# EAGLE design Sentral (EAGLE 7.7.0)

## Sheet 1 of 2
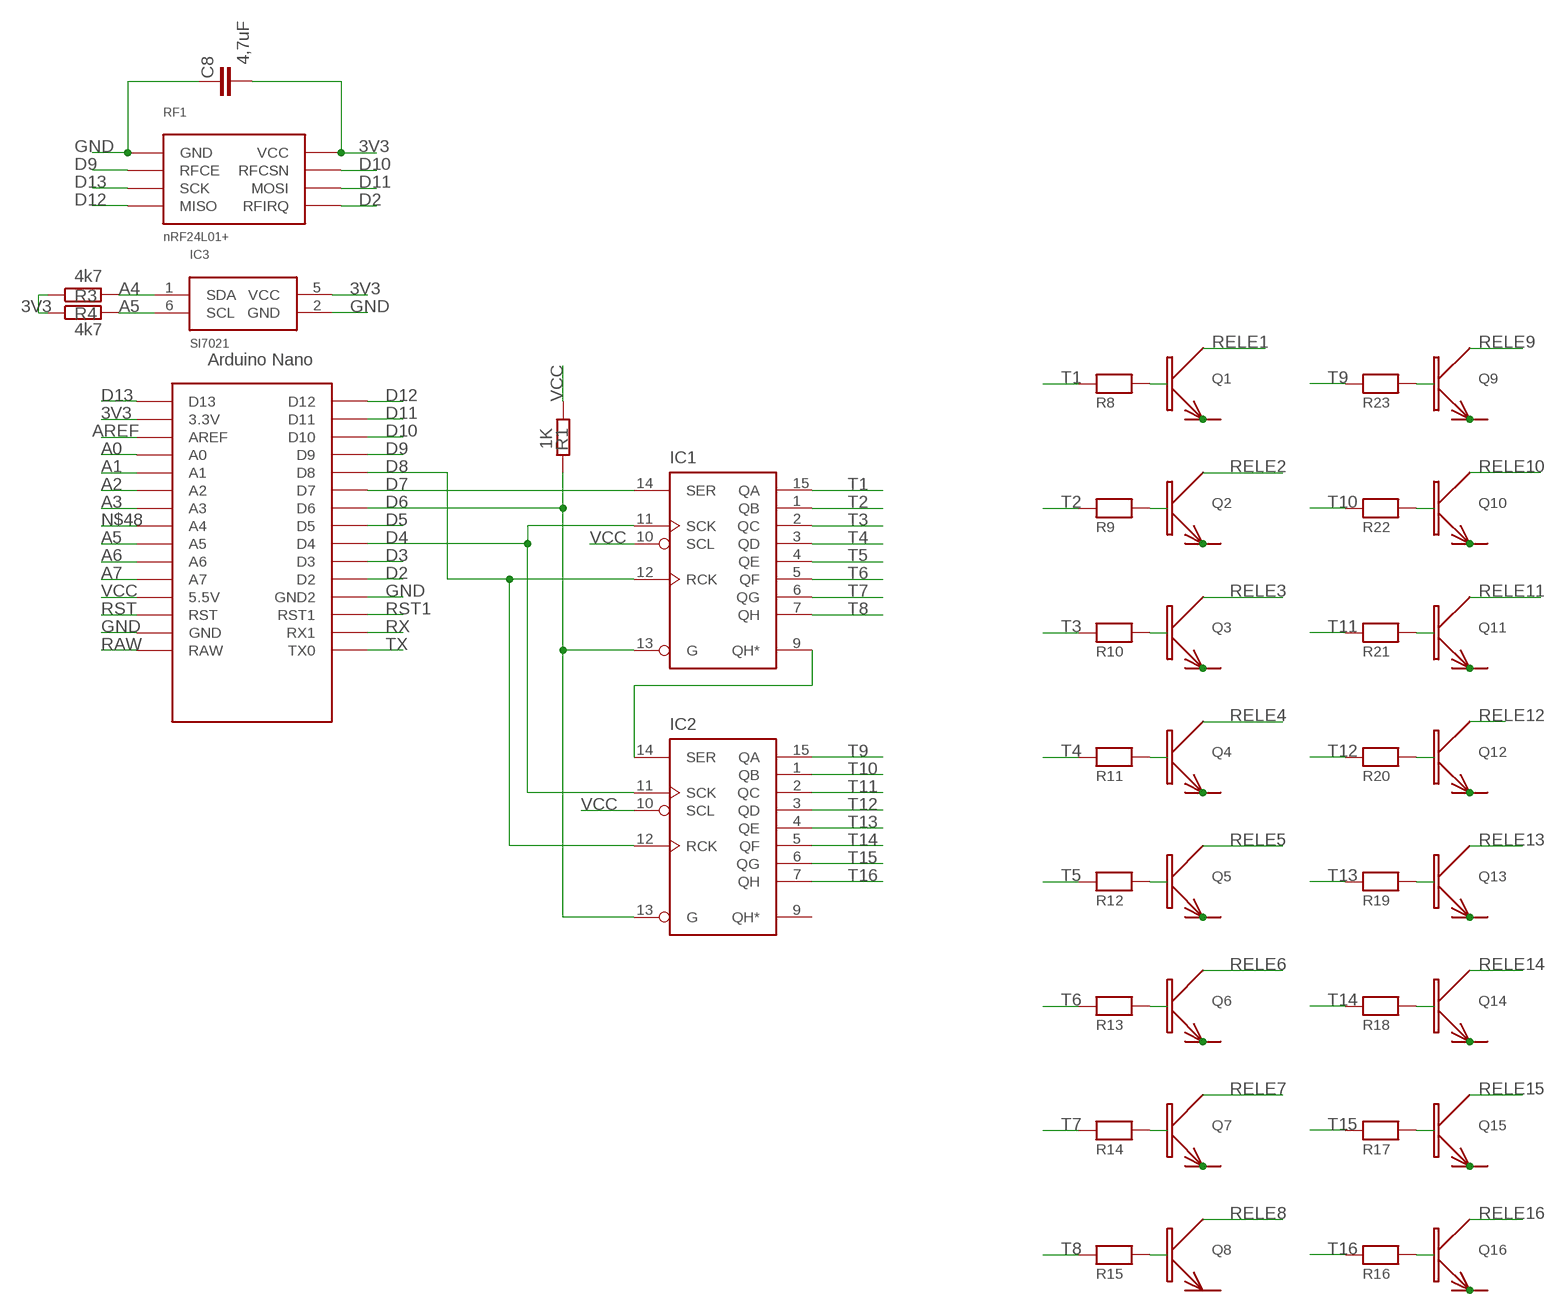
[diagram p0: schematic, sheet 1]

### Parts
C8  4,7uF  C-EUC4532  [C4532]
IC1  74595  [SO-16]
IC2  74595  [SO-16]
IC3  SI7021  [DFN6]
Q1  BC817  [SOT23]
Q2  BC817  [SOT23]
Q3  BC817  [SOT23]
Q4  BC817  [SOT23]
Q5  BC817  [SOT23]
Q6  BC817  [SOT23]
Q7  BC817  [SOT23]
Q8  BC817  [SOT23]
Q9  BC817  [SOT23]
Q10  BC817  [SOT23]
Q11  BC817  [SOT23]
Q12  BC817  [SOT23]
Q13  BC817  [SOT23]
Q14  BC817  [SOT23]
Q15  BC817  [SOT23]
Q16  BC817  [SOT23]
R1  1K  R-EU_R0805  [R0805]
R3  4k7  R-EU_R0805  [R0805]
R4  4k7  R-EU_R0805  [R0805]
R8  RES-A  [A]
R9  RES-A  [A]
R10  RES-A  [A]
R11  RES-A  [A]
R12  RES-A  [A]
R13  RES-A  [A]
R14  RES-A  [A]
R15  RES-A  [A]
R16  RES-A  [A]
R17  RES-A  [A]
R18  RES-A  [A]
R19  RES-A  [A]
R20  RES-A  [A]
R21  RES-A  [A]
R22  RES-A  [A]
R23  RES-A  [A]
RF1  nRF24L01+  NRF24L01  [2X4-2.54MM]
U$1  NANO  [NANO]

### Nets
3V3: C8.1 IC3.5(VCC) R3.1 R4.1 RF1.P$2(VCC) U$1.3.3V ; also sheet 2
A0: U$1.A0
A1: U$1.A1
A2: U$1.A2
A3: U$1.A3
A4: IC3.1(SDA) R3.2
A5: IC3.6(SCL) R4.2 U$1.A5
A6: U$1.A6
A7: U$1.A7
AREF: U$1.AREF
D2: RF1.P$8(RFIRQ) U$1.D2
D3: U$1.D3
D4: IC1.11(SCK) IC2.11(SCK) U$1.D4
D5: U$1.D5
D6: IC1.13(G) IC2.13(G) R1.2 U$1.D6
D7: IC1.14(SER) U$1.D7
D8: IC1.12(RCK) IC2.12(RCK) U$1.D8
D9: RF1.P$3(RFCE) U$1.D9
D10: RF1.P$4(RFCSN) U$1.D10
D11: RF1.P$6(MOSI) U$1.D11
D12: RF1.P$7(MISO) U$1.D12
D13: RF1.P$5(SCK) U$1.D13
GND: C8.2 IC3.2(GND) Q1.1(E) Q2.1(E) Q3.1(E) Q4.1(E) Q5.1(E) Q6.1(E) Q7.1(E) Q8.1(E) Q9.1(E) Q10.1(E) Q11.1(E) Q12.1(E) Q13.1(E) Q14.1(E) Q15.1(E) Q16.1(E) RF1.P$1(GND) U$1.GND U$1.GND1(GND2)
N$6: Q1.2(B) R8.2
N$7: Q2.2(B) R9.2
N$8: Q3.2(B) R10.2
N$9: Q4.2(B) R11.2
N$10: Q5.2(B) R12.2
N$11: Q6.2(B) R13.2
N$12: Q7.2(B) R14.2
N$13: Q8.2(B) R15.2
N$14: IC1.9(QH*) IC2.14(SER)
N$17: Q16.2(B) R16.2
N$18: Q15.2(B) R17.2
N$19: Q14.2(B) R18.2
N$20: Q13.2(B) R19.2
N$27: Q12.2(B) R20.2
N$28: Q11.2(B) R21.2
N$29: Q10.2(B) R22.2
N$36: Q9.2(B) R23.2
N$48: U$1.A4
RAW: U$1.RAW
RELE1: Q1.3(C) ; also sheet 2
RELE2: Q2.3(C) ; also sheet 2
RELE3: Q3.3(C) ; also sheet 2
RELE4: Q4.3(C) ; also sheet 2
RELE5: Q5.3(C) ; also sheet 2
RELE6: Q6.3(C) ; also sheet 2
RELE7: Q7.3(C) ; also sheet 2
RELE8: Q8.3(C) ; also sheet 2
RELE9: Q9.3(C) ; also sheet 2
RELE10: Q10.3(C) ; also sheet 2
RELE11: Q11.3(C) ; also sheet 2
RELE12: Q12.3(C) ; also sheet 2
RELE13: Q13.3(C) ; also sheet 2
RELE14: Q14.3(C) ; also sheet 2
RELE15: Q15.3(C) ; also sheet 2
RELE16: Q16.3(C) ; also sheet 2
RST: U$1.RST
RST1: U$1.RST1
RX: U$1.RX1
T1: IC1.15(QA) R8.1
T2: IC1.1(QB) R9.1
T3: IC1.2(QC) R10.1
T4: IC1.3(QD) R11.1
T5: IC1.4(QE) R12.1
T6: IC1.5(QF) R13.1
T7: IC1.6(QG) R14.1
T8: IC1.7(QH) R15.1
T9: IC2.15(QA) R23.1
T10: IC2.1(QB) R22.1
T11: IC2.2(QC) R21.1
T12: IC2.3(QD) R20.1
T13: IC2.4(QE) R19.1
T14: IC2.5(QF) R18.1
T15: IC2.6(QG) R17.1
T16: IC2.7(QH) R16.1
TX: U$1.TX0
VCC: IC1.10(SCL) IC2.10(SCL) R1.1 U$1.5V(5.5V)
Unconnected: IC2.9(QH*) U$1.ICSP1 U$1.ICSP2 U$1.ICSP3 U$1.ICSP4 U$1.ICSP5 U$1.ICSP6

## Sheet 2 of 2
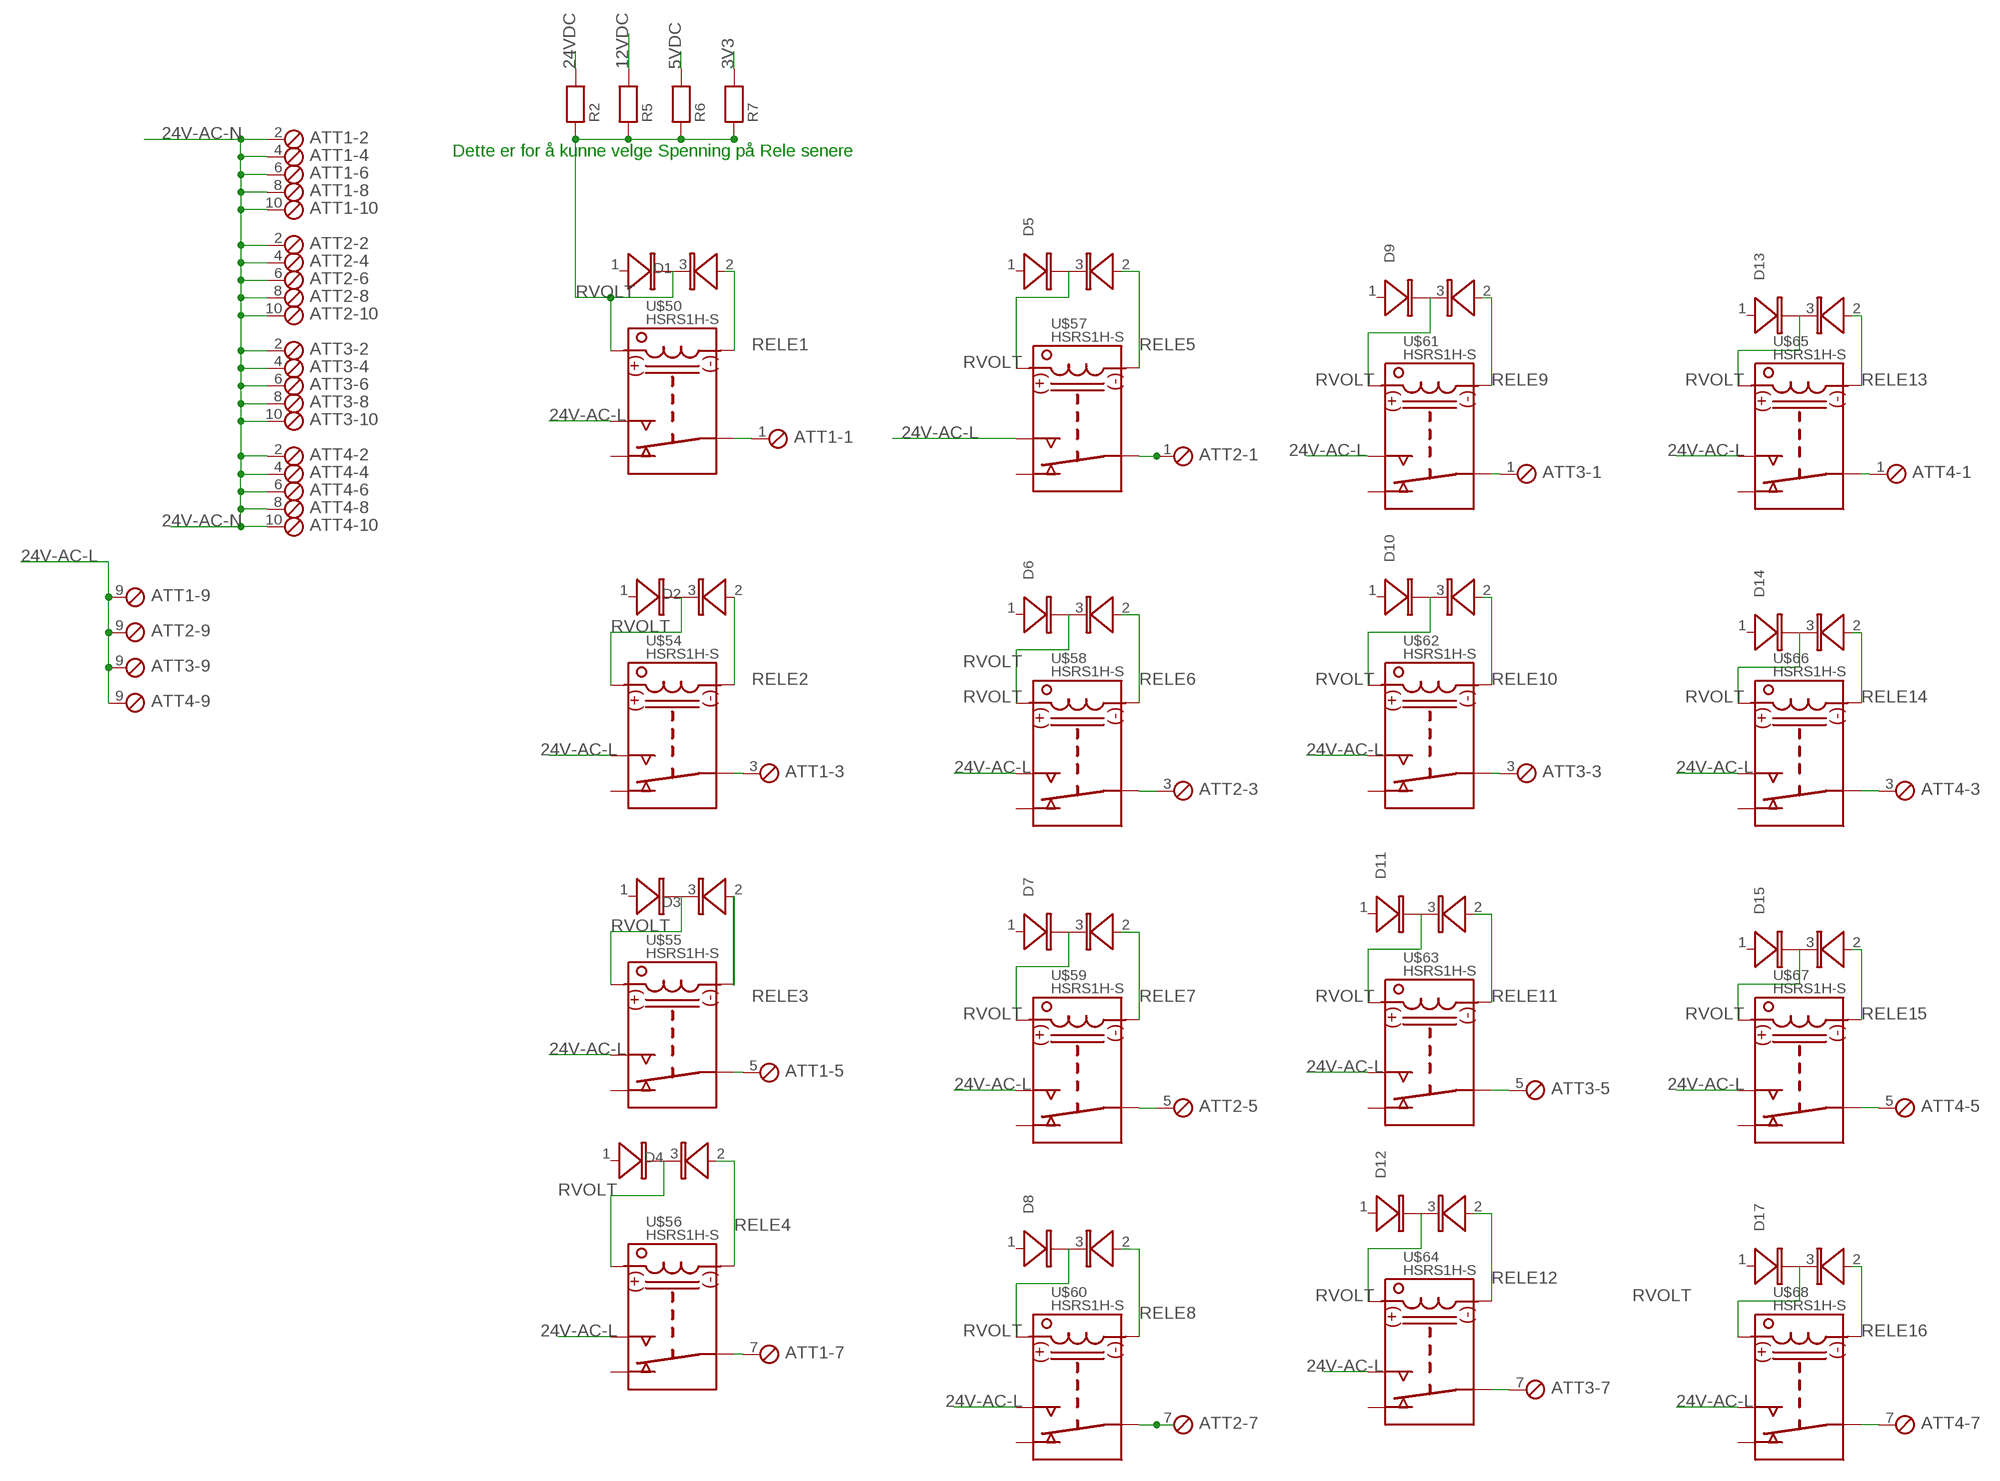
[diagram p1: schematic, sheet 2]

### Parts
ATT1  MPT10  [10POL254]
ATT2  MPT10  [10POL254]
ATT3  MPT10  [10POL254]
ATT4  MPT10  [10POL254]
D1  BAV70  [SOT23]
D2  BAV70  [SOT23]
D3  BAV70  [SOT23]
D4  BAV70  [SOT23]
D5  BAV70  [SOT23]
D6  BAV70  [SOT23]
D7  BAV70  [SOT23]
D8  BAV70  [SOT23]
D9  BAV70  [SOT23]
D10  BAV70  [SOT23]
D11  BAV70  [SOT23]
D12  BAV70  [SOT23]
D13  BAV70  [SOT23]
D14  BAV70  [SOT23]
D15  BAV70  [SOT23]
D17  BAV70  [SOT23]
R2  RES-C  [C]
R5  RES-C  [C]
R6  RES-C  [C]
R7  RES-C  [C]
U$50  HSRS1H-S  [DIL12RLY]
U$54  HSRS1H-S  [DIL12RLY]
U$55  HSRS1H-S  [DIL12RLY]
U$56  HSRS1H-S  [DIL12RLY]
U$57  HSRS1H-S  [DIL12RLY]
U$58  HSRS1H-S  [DIL12RLY]
U$59  HSRS1H-S  [DIL12RLY]
U$60  HSRS1H-S  [DIL12RLY]
U$61  HSRS1H-S  [DIL12RLY]
U$62  HSRS1H-S  [DIL12RLY]
U$63  HSRS1H-S  [DIL12RLY]
U$64  HSRS1H-S  [DIL12RLY]
U$65  HSRS1H-S  [DIL12RLY]
U$66  HSRS1H-S  [DIL12RLY]
U$67  HSRS1H-S  [DIL12RLY]
U$68  HSRS1H-S  [DIL12RLY]

### Nets
3V3: R7.2 ; also sheet 1
5VDC: R6.2
12VDC: R5.2
24V-AC-L: ATT1.9 ATT2.9 ATT3.9 ATT4.9 U$50.1 U$54.1 U$55.1 U$56.1 U$57.1 U$58.1 U$59.1 U$60.1 U$61.1 U$62.1 U$63.1 U$64.1 U$65.1 U$66.1 U$67.1 U$68.1
24V-AC-N: ATT1.2 ATT1.4 ATT1.6 ATT1.8 ATT1.10 ATT2.2 ATT2.4 ATT2.6 ATT2.8 ATT2.10 ATT3.2 ATT3.4 ATT3.6 ATT3.8 ATT3.10 ATT4.2 ATT4.4 ATT4.6 ATT4.8 ATT4.10
24VDC: R2.2
N$1: ATT2.1 U$57.6(6,7) U$57.7(6,7)
N$2: ATT2.3 U$58.6(6,7) U$58.7(6,7)
N$3: ATT2.5 U$59.6(6,7) U$59.7(6,7)
N$4: ATT2.7 U$60.6(6,7) U$60.7(6,7)
N$16: ATT1.1 U$50.6(6,7) U$50.7(6,7)
N$25: ATT1.3 U$54.6(6,7) U$54.7(6,7)
N$34: ATT1.5 U$55.6(6,7) U$55.7(6,7)
N$38: ATT3.7 U$64.6(6,7) U$64.7(6,7)
N$40: ATT4.1 U$65.6(6,7) U$65.7(6,7)
N$41: ATT3.5 U$63.6(6,7) U$63.7(6,7)
N$42: ATT3.3 U$62.6(6,7) U$62.7(6,7)
N$43: ATT3.1 U$61.6(6,7) U$61.7(6,7)
N$44: ATT4.3 U$66.6(6,7) U$66.7(6,7)
N$45: ATT4.5 U$67.6(6,7) U$67.7(6,7)
N$47: ATT4.7 U$68.6(6,7) U$68.7(6,7)
N$64: ATT1.7 U$56.6(6,7) U$56.7(6,7)
RELE1: D1.2(A2) U$50.11 ; also sheet 1
RELE2: D2.2(A2) U$54.11 ; also sheet 1
RELE3: D3.2(A2) U$55.11 ; also sheet 1
RELE4: D4.2(A2) U$56.11 ; also sheet 1
RELE5: D5.2(A2) U$57.11 ; also sheet 1
RELE6: D6.2(A2) U$58.11 ; also sheet 1
RELE7: D7.2(A2) U$59.11 ; also sheet 1
RELE8: D8.2(A2) U$60.11 ; also sheet 1
RELE9: D9.2(A2) U$61.11 ; also sheet 1
RELE10: D10.2(A2) U$62.11 ; also sheet 1
RELE11: D11.2(A2) U$63.11 ; also sheet 1
RELE12: D12.2(A2) U$64.11 ; also sheet 1
RELE13: D13.2(A2) U$65.11 ; also sheet 1
RELE14: D14.2(A2) U$66.11 ; also sheet 1
RELE15: D15.2(A2) U$67.11 ; also sheet 1
RELE16: D17.2(A2) U$68.11 ; also sheet 1
RVOLT: D1.3(K) D2.3(K) D3.3(K) D4.3(K) D5.3(K) D6.3(K) D7.3(K) D8.3(K) D9.3(K) D10.3(K) D11.3(K) D12.3(K) D13.3(K) D14.3(K) D15.3(K) D17.3(K) R2.1 R5.1 R6.1 R7.1 U$50.2 U$54.2 U$55.2 U$56.2 U$57.2 U$58.2 U$59.2 U$60.2 U$61.2 U$62.2 U$63.2 U$64.2 U$65.2 U$66.2 U$67.2 U$68.2
Unconnected: D1.1(A1) D2.1(A1) D3.1(A1) D4.1(A1) D5.1(A1) D6.1(A1) D7.1(A1) D8.1(A1) D9.1(A1) D10.1(A1) D11.1(A1) D12.1(A1) D13.1(A1) D14.1(A1) D15.1(A1) D17.1(A1) U$50.12 U$54.12 U$55.12 U$56.12 U$57.12 U$58.12 U$59.12 U$60.12 U$61.12 U$62.12 U$63.12 U$64.12 U$65.12 U$66.12 U$67.12 U$68.12

### Notes on the sheet
- Dette er for å kunne velge Spenning på Rele senere

## Power pins joined to a net without a drawn wire
GND: IC1.8(GND) IC2.8(GND)
VCC: IC1.16(VCC) IC2.16(VCC)

## Library data of the parts
ATT1-ATT4 = con-phoenix-254:MPT10: PHOENIX CONNECTOR
C8 = rcl:C-EU: CAPACITOR, European symbol
D1-D15 D17 = DISC-SMD:BAV70
IC1 IC2 = 74XXSMD:74595
IC3 = Sensor:SI7021
Q1-Q16 = DISC-SMD:BC817
R1 R3 R4 = rcl:R-EU_: RESISTOR, European symbol
R2 R5-R7 = rlc-smd:RES-C
R8-R23 = rlc-smd:RES-A
RF1 = matrix:NRF24L01
U$1 = AWP-Lib2:NANO: Arduino Nano
U$50 U$54-U$68 = Relay-IKE:HSRS1H-S

## Net classes
0 default: width 0.203 mm

## Board
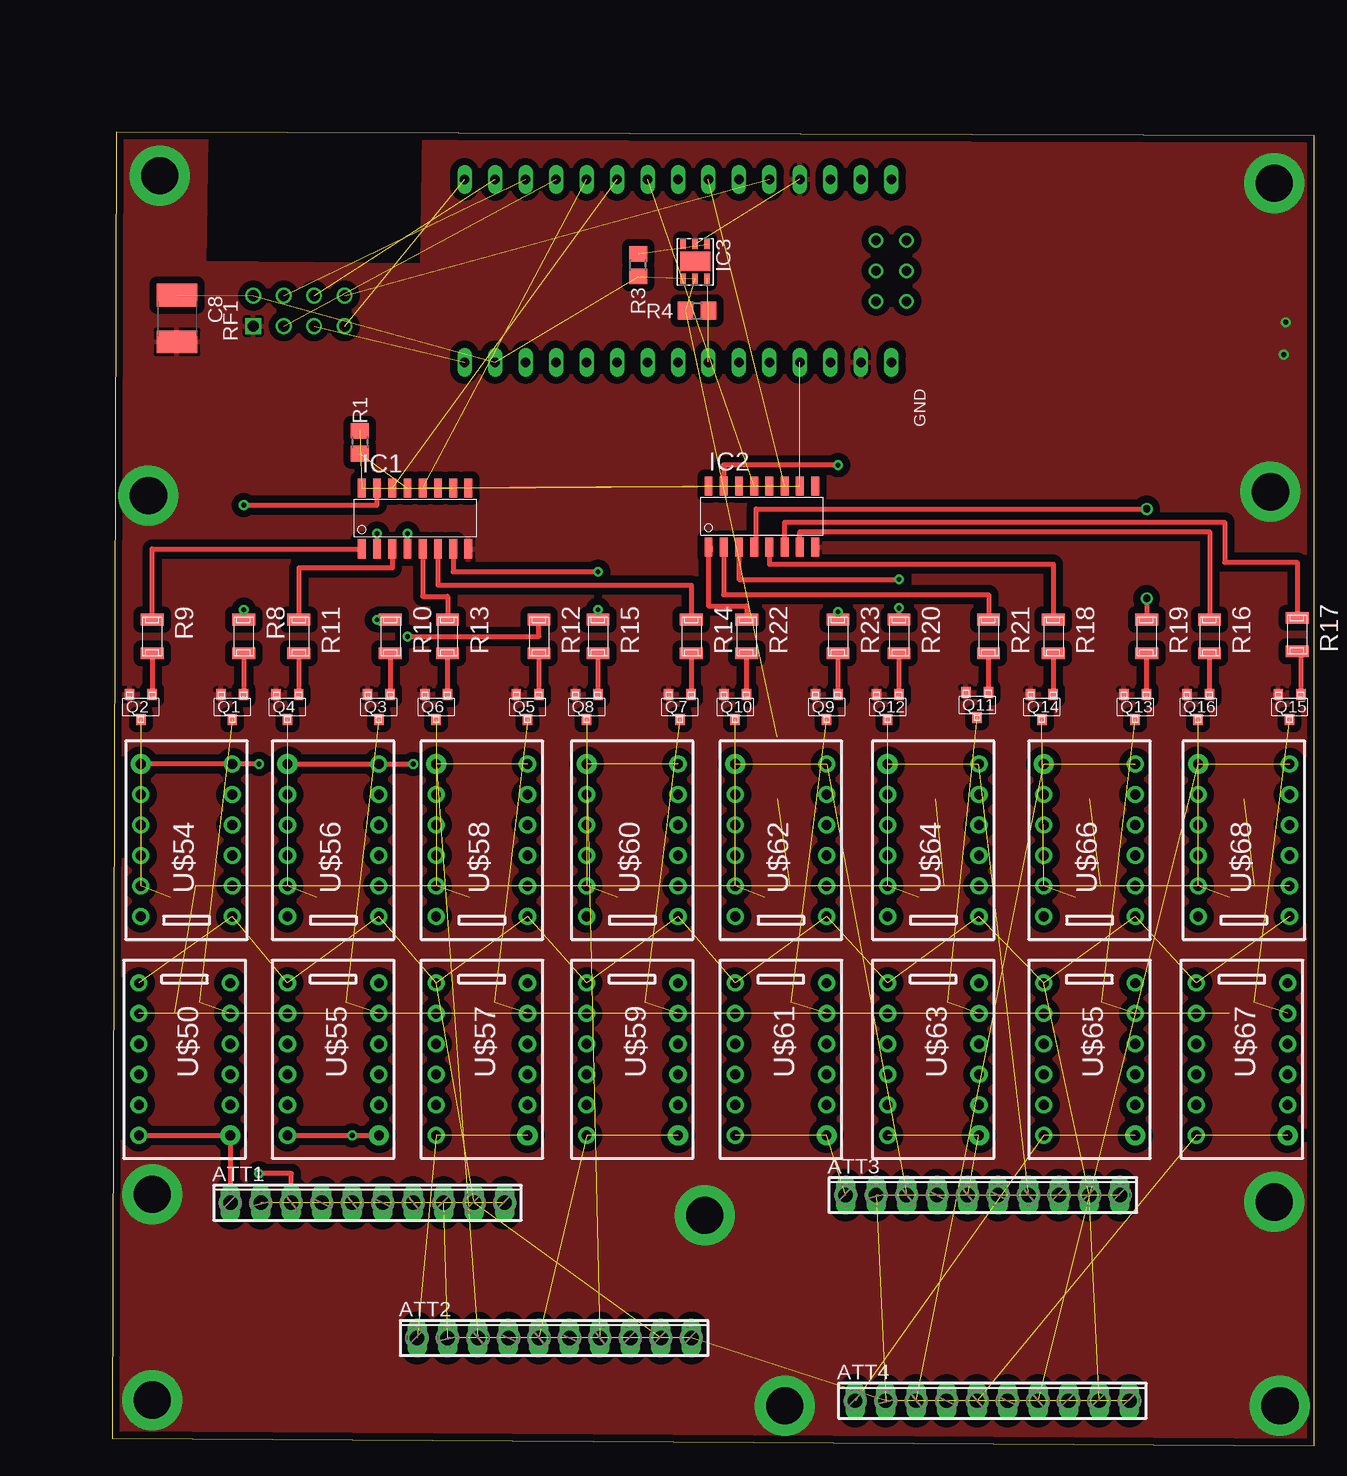
[diagram p2: board, top side]
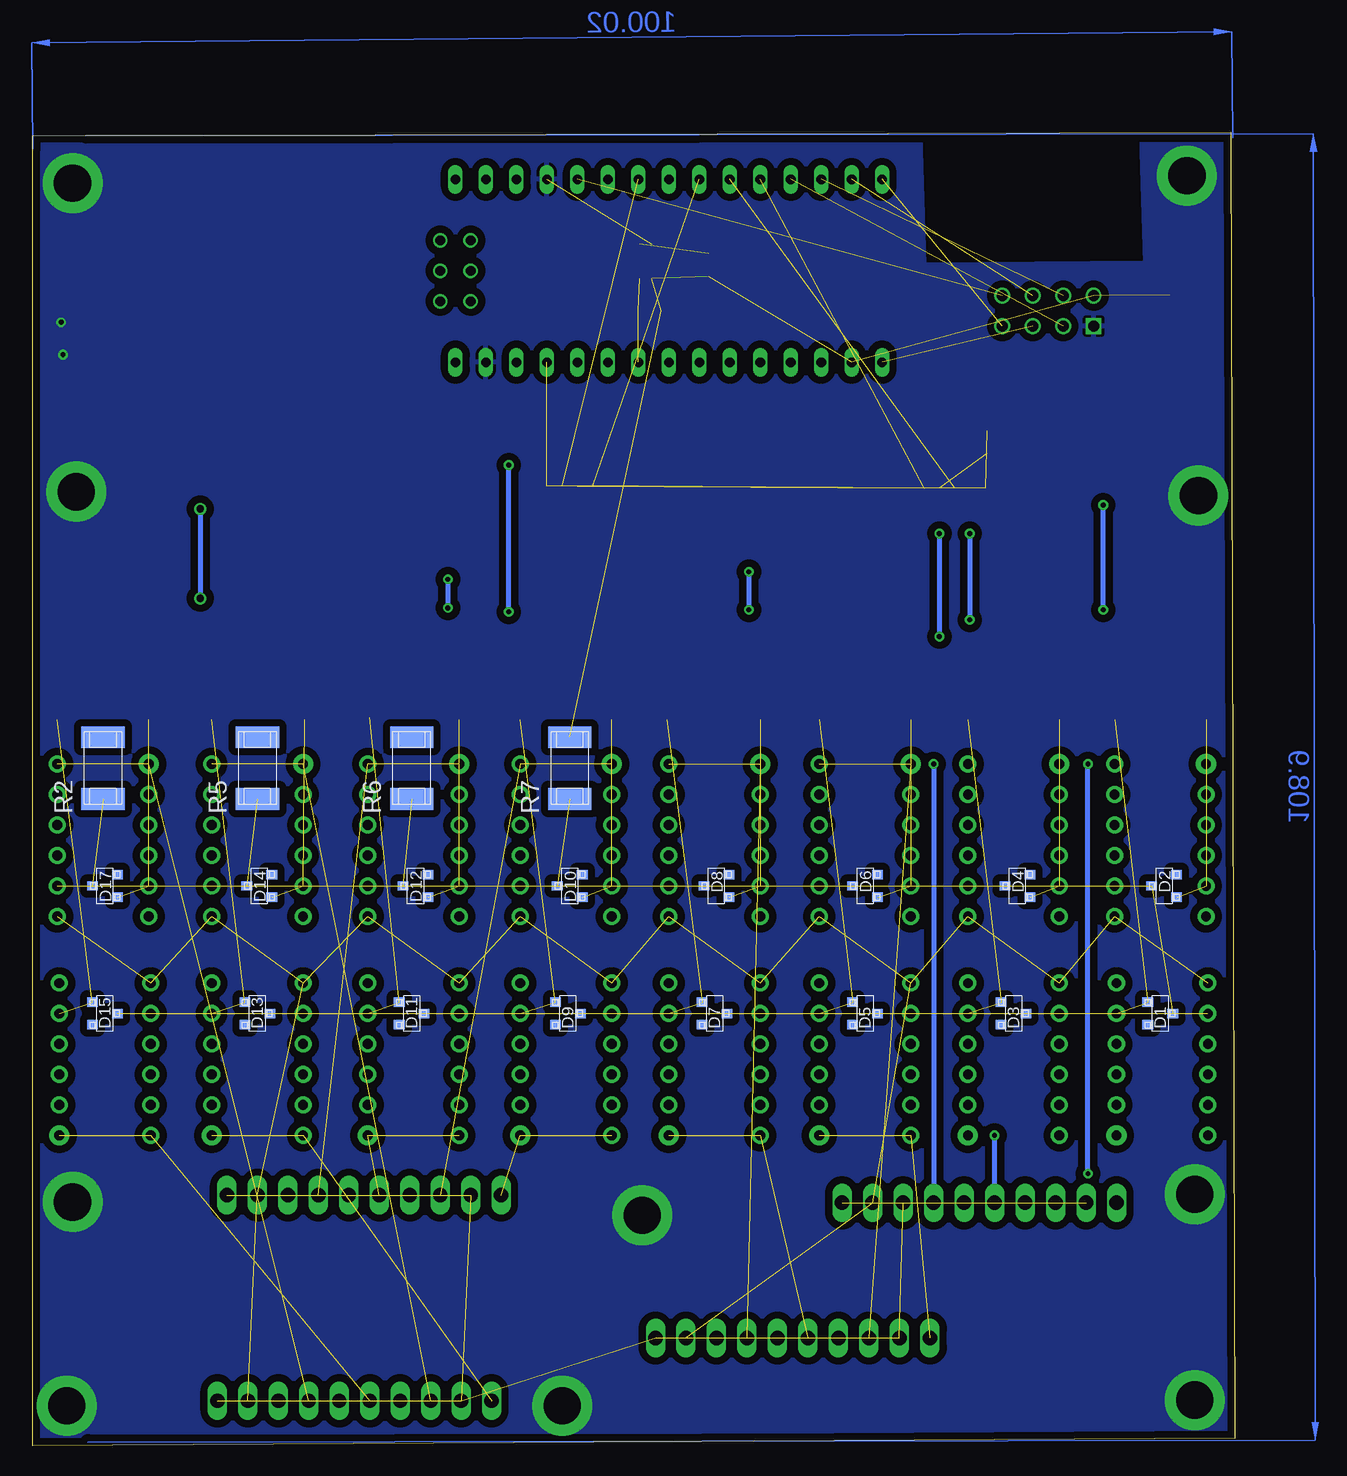
[diagram p3: board, bottom side, seen from below]

Size 100.15 x 109.52 mm. Coordinates in mm from the lower left corner, seen from the top.
Outline: 0,0.64 100.15,0 100.15,109.21 0.32,109.52 0,0.64
Copper layers (1*16): Top 0.035mm / dielectric 1.5mm / Bottom 0.035mm
Design rules "8mil_capinor": minimum track width 4mil, minimum drill 0.2997mm, track to track 8mil, track to pad 8mil, pad to pad 8mil, via to via 8mil, smd to smd 0mil, copper to edge 16mil, drill to drill 16mil, minimum pad ring 8mil, minimum via ring 8mil, stop-mask expansion 0mil, vias tented up to drill 16mil, thermal gap 10mil

### Footprints (pad centres in the part's own frame; a part is rotated, then mirrored left to right if it is on the bottom)
10POL254 = drill 1.2 long: 1 -11.43,0; 2 -8.89,0; 3 -6.35,0; 4 -3.81,0; 5 -1.27,0; 6 1.27,0; 7 3.81,0; 8 6.35,0; 9 8.89,0; 10 11.43,0
C4532 = smd 1.9 x 3.4: 1 -1.95,0; 2 1.95,0
SOT23 = smd 0.889 x 0.787: 1 -1.041,-0.94; 2 -1.041,0.94; 3 1.041,0
SO-16 = smd 0.66 x 1.6: 1 -4.445,-2.54; 2 -3.175,-2.54; 3 -1.905,-2.54; 4 -0.635,-2.54; 5 0.635,-2.54; 6 1.905,-2.54; 7 3.175,-2.54; 8 4.445,-2.54; 9 4.445,2.54; 10 3.175,2.54; 11 1.905,2.54; 12 0.635,2.54; 13 -0.635,2.54; 14 -1.905,2.54; 15 -3.175,2.54; 16 -4.445,2.54
DFN6 = smd 0.85 x 0.45: 1 -1.45,1; 2 -1.45,0; 3 -1.45,-1; 4 1.45,-1; 5 1.45,0; 6 1.45,1 | smd 1.6 x 2.5: P$1 0,0
R0805 = smd 1.3 x 1.5: 1 -0.95,0; 2 0.95,0
C = smd 1.803 x 3.607: 1 -2.591,0; 2 2.565,0
A = smd 0.991 x 1.905: 1 -1.397,0; 2 1.397,0
2X4-2.54MM = drill 0.9 square: P$1 0,0 | drill 0.9: P$2 2.54,0; P$3 0,-2.54; P$4 2.54,-2.54; P$5 0,-5.08; P$6 2.54,-5.08; P$7 0,-7.62; P$8 2.54,-7.62
NANO = drill 0.8 long: 3.3V -10.16,24.13; 5V -10.16,-1.27; A0 -10.16,19.05; A1 -10.16,16.51; A2 -10.16,13.97; A3 -10.16,11.43; A4 -10.16,8.89; A5 -10.16,6.35; A6 -10.16,3.81; A7 -10.16,1.27; AREF -10.16,21.59; D2 5.08,1.27; D3 5.08,3.81; D4 5.08,6.35; D5 5.08,8.89; D6 5.08,11.43; D7 5.08,13.97; D8 5.08,16.51; D9 5.08,19.05; D10 5.08,21.59; D11 5.08,24.13; D12 5.08,26.67; D13 -10.16,26.67; GND -10.16,-6.35; GND1 5.08,-1.27; RAW -10.16,-8.89; RST -10.16,-3.81; RST1 5.08,-3.81; RX1 5.08,-6.35; TX0 5.08,-8.89 | drill 0.8: ICSP1 -5.08,-10.16; ICSP2 -5.08,-7.62; ICSP3 -2.54,-10.16; ICSP4 -2.54,-7.62; ICSP5 0,-10.16; ICSP6 0,-7.62
DIL12RLY = drill 0.813 pad 1.422: 1 -7.62,-2.54; 2 -5.08,-2.54; 3 -2.54,-2.54; 4 0,-2.54; 5 2.54,-2.54; 6 5.08,-2.54; 8 2.54,5.08; 9 0,5.08; 10 -2.54,5.08; 11 -5.08,5.08; 12 -7.62,5.08 | drill 0.813 pad 1.676: 7 5.08,5.08

### Placement (x,y rotation side)
ATT1  21.27,20.26 0 top
ATT2  36.83,8.99 0 top
ATT3  72.55,20.9 0 top
ATT4  73.34,3.75 0 top
C8  5.4,93.98 270 top
D1  6.19,36.04 0 bottom
D2  5.87,46.67 180 bottom
D3  18.41,36.04 0 bottom
D4  18.1,46.67 180 bottom
D5  30.8,36.04 0 bottom
D6  30.8,46.67 180 bottom
D7  43.34,36.04 0 bottom
D8  43.18,46.67 180 bottom
D9  55.56,36.04 0 bottom
D10  55.4,46.67 180 bottom
D11  68.58,36.04 0 bottom
D12  68.26,46.67 180 bottom
D13  81.44,36.04 0 bottom
D14  81.28,46.67 180 bottom
D15  94.14,36.04 0 bottom
D17  94.14,46.67 180 bottom
IC1  25.24,77.31 0 top
IC2  54.13,77.47 0 top
IC3  48.58,98.74 270 top
Q1  10,61.59 270 top
Q2  2.38,61.59 270 top
Q3  22.22,61.59 270 top
Q4  14.6,61.59 270 top
Q5  34.61,61.59 270 top
Q6  26.99,61.59 270 top
Q7  47.31,61.59 270 top
Q8  39.53,61.59 270 top
Q9  59.53,61.59 270 top
Q10  51.91,61.59 270 top
Q11  72.07,61.75 270 top
Q12  64.61,61.59 270 top
Q13  85.25,61.59 270 top
Q14  77.47,61.59 270 top
Q15  98.11,61.59 270 top
Q16  90.49,61.59 270 top
R1  20.64,83.66 270 top
R2  94.3,56.52 90 bottom
R3  43.81,98.42 90 top
R4  48.74,94.61 0 top
R5  81.44,56.52 90 bottom
R6  68.58,56.52 90 bottom
R7  55.4,56.52 90 bottom
R8  10.95,67.47 270 top
R9  3.33,67.47 270 top
R10  23.18,67.47 270 top
R11  15.56,67.47 270 top
R12  35.56,67.47 270 top
R13  27.94,67.47 270 top
R14  48.26,67.47 270 top
R15  40.48,67.47 270 top
R16  91.44,67.47 270 top
R17  98.74,67.63 270 top
R18  78.42,67.47 270 top
R19  86.2,67.47 270 top
R20  65.56,67.47 270 top
R21  73.02,67.47 270 top
R22  52.86,67.47 270 top
R23  60.48,67.47 270 top
RF1  11.75,93.34 90 top
U$1  56.04,100.49 90 top
U$50  4.76,30.96 270 top
U$54  7.46,51.75 90 top
U$55  17.14,30.96 270 top
U$56  19.68,51.75 90 top
U$57  29.53,30.96 270 top
U$58  32.07,51.75 90 top
U$59  42.07,30.96 270 top
U$60  44.61,51.75 90 top
U$61  54.45,30.96 270 top
U$62  56.99,51.75 90 top
U$63  67.15,30.96 270 top
U$64  69.69,51.75 90 top
U$65  80.17,30.96 270 top
U$66  82.71,51.75 90 top
U$67  92.87,30.96 270 top
U$68  95.57,51.75 90 top

### Tracks (layer width: path | path; a pad name or v marks a point on that pad's centre or on a via)
3V3  (6 unrouted)
24V-AC-L  (19 unrouted)
24V-AC-N  (19 unrouted)
A4  (1 unrouted)
A5  (2 unrouted)
D2  (1 unrouted)
D4  (2 unrouted)
D6  (3 unrouted)
D7  (1 unrouted)
D8  (2 unrouted)
D9  (1 unrouted)
D10  (1 unrouted)
D11  (1 unrouted)
D12  (1 unrouted)
D13  (1 unrouted)
GND  (via drill 0.4, 3.1 pad 5)  (1 unrouted)
  Top 0.406: IC2.8 58.59,74.93
  other vias: 3.97,105.89 97.79,93.66 97.63,90.96 3.33,3.81 96.84,105.25 3.02,79.22 97.31,3.33 56.04,3.33 96.52,79.53 96.84,20.32 49.37,19.21 3.33,20.95
  pour Bottom (isolate 0.61): 0.32,109.22 7.78,109.22 7.46,98.58 25.88,98.42 26.19,109.38 100.01,109.06 100.49,87.63 100.49,0 -0.16,0.48
  pour Top (isolate 0.61): 0.32,109.22 7.78,109.22 7.62,98.58 25.88,98.42 26.03,109.38 100.33,108.9 100.65,85.09 100.65,0.16 0.16,0.48
N$1  (2 unrouted)
N$2  (2 unrouted)
N$3  (2 unrouted)
N$4  (2 unrouted)
N$6
  Top 0.406: R8.2 10.94,66.07 Q1.2
N$7
  Top 0.406: R9.2 3.32,66.07 Q2.2
N$8
  Top 0.406: R10.2 23.17,66.07 Q3.2
N$9
  Top 0.406: R11.2 Q4.2
N$10
  Top 0.406: R12.2 Q5.2
N$11
  Top 0.406: R13.2 Q6.2
N$12
  Top 0.406: R14.2 Q7.2
N$13
  Top 0.406: R15.2 40.47,66.07 Q8.2
N$14  (1 unrouted)
N$16
  Top 0.406: U$50.6 U$50.7 ATT1.1
N$17
  Top 0.406: R16.2 Q16.2
N$18
  Top 0.406: R17.2 99.05,66.23 Q15.2
N$19
  Top 0.406: R18.2 78.41,66.07 Q14.2
N$20
  Top 0.406: R19.2 Q13.2
N$25  (via drill 0.4)
  Top 0.406: ATT1.3 14.92,22.7 v12.22,22.7 | v12.22,56.83 U$54.6 U$54.7
  Bottom 0.406: v12.22,22.7 v12.22,56.83
N$27
  Top 0.406: R20.2 65.55,66.07 Q12.2
N$28
  Top 0.406: R21.2 73.01,66.07 Q11.2
N$29
  Top 0.406: R22.2 52.85,66.07 Q10.2
N$34  (via drill 0.4)
  Top 0.406: U$55.6 v20,25.88 U$55.7
  Bottom 0.406: ATT1.5 v20,25.88
N$36
  Top 0.406: R23.2 60.47,66.07 Q9.2
N$38  (2 unrouted)
N$40  (2 unrouted)
N$41  (2 unrouted)
N$42  (2 unrouted)
N$43  (2 unrouted)
N$44  (2 unrouted)
N$45  (2 unrouted)
N$47  (2 unrouted)
N$64  (via drill 0.4)
  Top 0.406: U$56.7 U$56.6 v25.08,56.83
  Bottom 0.406: v25.08,56.83 ATT1.7
RELE1  (2 unrouted)
RELE2  (2 unrouted)
RELE3  (2 unrouted)
RELE4  (2 unrouted)
RELE5  (2 unrouted)
RELE6  (2 unrouted)
RELE7  (2 unrouted)
RELE8  (2 unrouted)
RELE9  (2 unrouted)
RELE10  (2 unrouted)
RELE11  (2 unrouted)
RELE12  (2 unrouted)
RELE13  (2 unrouted)
RELE14  (2 unrouted)
RELE15  (2 unrouted)
RELE16  (2 unrouted)
RVOLT  (35 unrouted)
T1  (via drill 0.4)
  Top 0.406: R8.1 v10.95,69.69 | v10.95,78.42 22.07,78.42 IC1.15
  Bottom 0.406: v10.95,69.69 v10.95,78.42
T2
  Top 0.406: R9.1 3.33,74.77 IC1.1
T3  (via drill 0.4)
  Top 0.406: IC1.2 v22.07,76.04 | v22.07,68.87 R10.1
  Bottom 0.406: v22.07,76.04 v22.07,68.87
T4
  Top 0.406: IC1.3 23.34,73.18 15.56,73.18 R11.1
T5  (via drill 0.4)
  Top 0.406: IC1.4 v24.61,76.04 | v24.61,67.47 35.56,67.47 R12.1
  Bottom 0.406: v24.61,76.04 v24.61,67.47
T6
  Top 0.406: IC1.5 25.88,70.8 27.94,70.8 R13.1
T7
  Top 0.406: IC1.6 27.15,71.75 48.26,71.75 R14.1
T8  (via drill 0.4)
  Top 0.406: IC1.7 28.42,72.87 v40.48,72.87 | v40.48,69.69 R15.1
  Bottom 0.406: v40.48,72.87 v40.48,69.69
T9  (via drill 0.4)
  Top 0.406: R23.1 v60.48,69.53 | v60.48,81.76 50.96,81.76 IC2.15
  Bottom 0.406: v60.48,69.53 v60.48,81.76
T10
  Top 0.406: IC2.1 49.85,74.93 49.85,74.61 49.69,74.61 49.69,70.01 52.86,70.01 R22.1
T11
  Top 0.406: IC2.2 50.96,70.96 73.03,70.96 R21.1
T12  (via drill 0.4)
  Top 0.406: IC2.3 52.23,72.23 v65.56,72.23 | v65.56,69.85 R20.1
  Bottom 0.406: v65.56,72.23 v65.56,69.85
T13  (via drill 0.6)
  Top 0.406: IC2.4 53.66,74.93 53.66,78.1 v86.2,78.1 | v86.2,70.64 R19.1
  Bottom 0.406: v86.2,78.1 v86.2,70.64
T14
  Top 0.406: IC2.5 54.77,73.5 78.42,73.5 R18.1
T15
  Top 0.406: IC2.6 56.04,76.99 92.71,76.99 92.71,73.66 98.74,73.66 R17.1
T16
  Top 0.406: IC2.7 57.31,76.2 91.44,76.2 R16.1
VCC  (5 unrouted)
(copper drawn outside any net)
  shapes: Bottom area x2

### Text on the board
_tsilk: GND